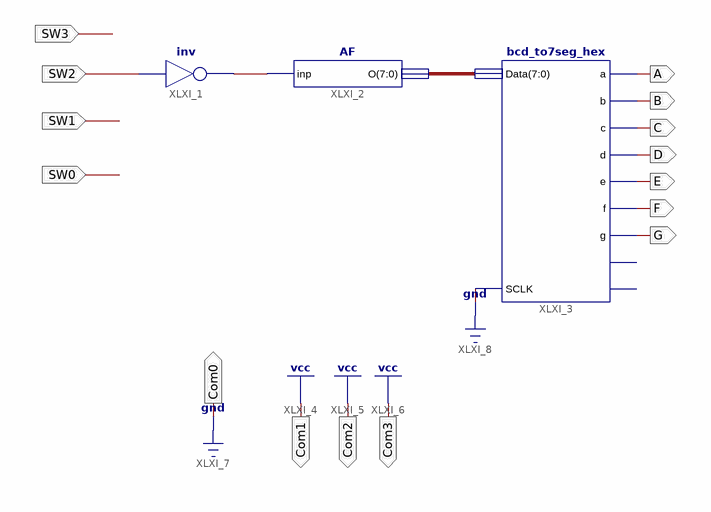
[diagram p0: schematic sheet 1]
// Xilinx ISE schematic main.sch (spartan6) as structural Verilog: 3 symbols, 15 ports
module main (
  input  SW3,
  input  SW2,
  input  SW1,
  input  SW0,
  output A,
  output B,
  output C,
  output D,
  output E,
  output F,
  output G,
  output Com0,
  output Com1,
  output Com2,
  output Com3
);

  wire XLXN_5;
  wire [7:0] XLXN_6;

  not XLXI_1 (XLXN_5, SW2);
  AF XLXI_2 (.inp(XLXN_5), .O(XLXN_6));
  bcd_to7seg_hex XLXI_3 (
    .Data(XLXN_6), .SCLK(1'b0), .a(A), .b(B), .c(C), .d(D), .e(E), .f(F), .g(G));  // open: Com0, Com1

  assign Com0 = 1'b0;
  assign Com1 = 1'b1;
  assign Com2 = 1'b1;
  assign Com3 = 1'b1;
endmodule
